# Altium schematic sheet 30. MICRO SDCARD INTERFACE.SchDoc: uSD CARD INTERFACE
size 513 x 386 mm; Project: PROC154E2(001)_SK_AM69; Issue: 1.0; RevCode: E3; Page Create Date: March  8, 1995; Variant Name: Core Design; Schematic Page Number: 30; Page Number: 30; Page Size: C; Comment: MISTRAL_TITLEBLK_CSIZE_1; Page Count: 62; Schematic Page Count: 62; Name: PROC154E2 001 SK AM69; DsnPath: C:\Users\danie\Downloads\sprr466c\PROC154E3_RP\PROC154E3_SCH.DSN; SchematicName: SCHEMATIC1; PageName: 30. MICRO SDCARD INTERFACE; PageSize: C; TopSchematic: True
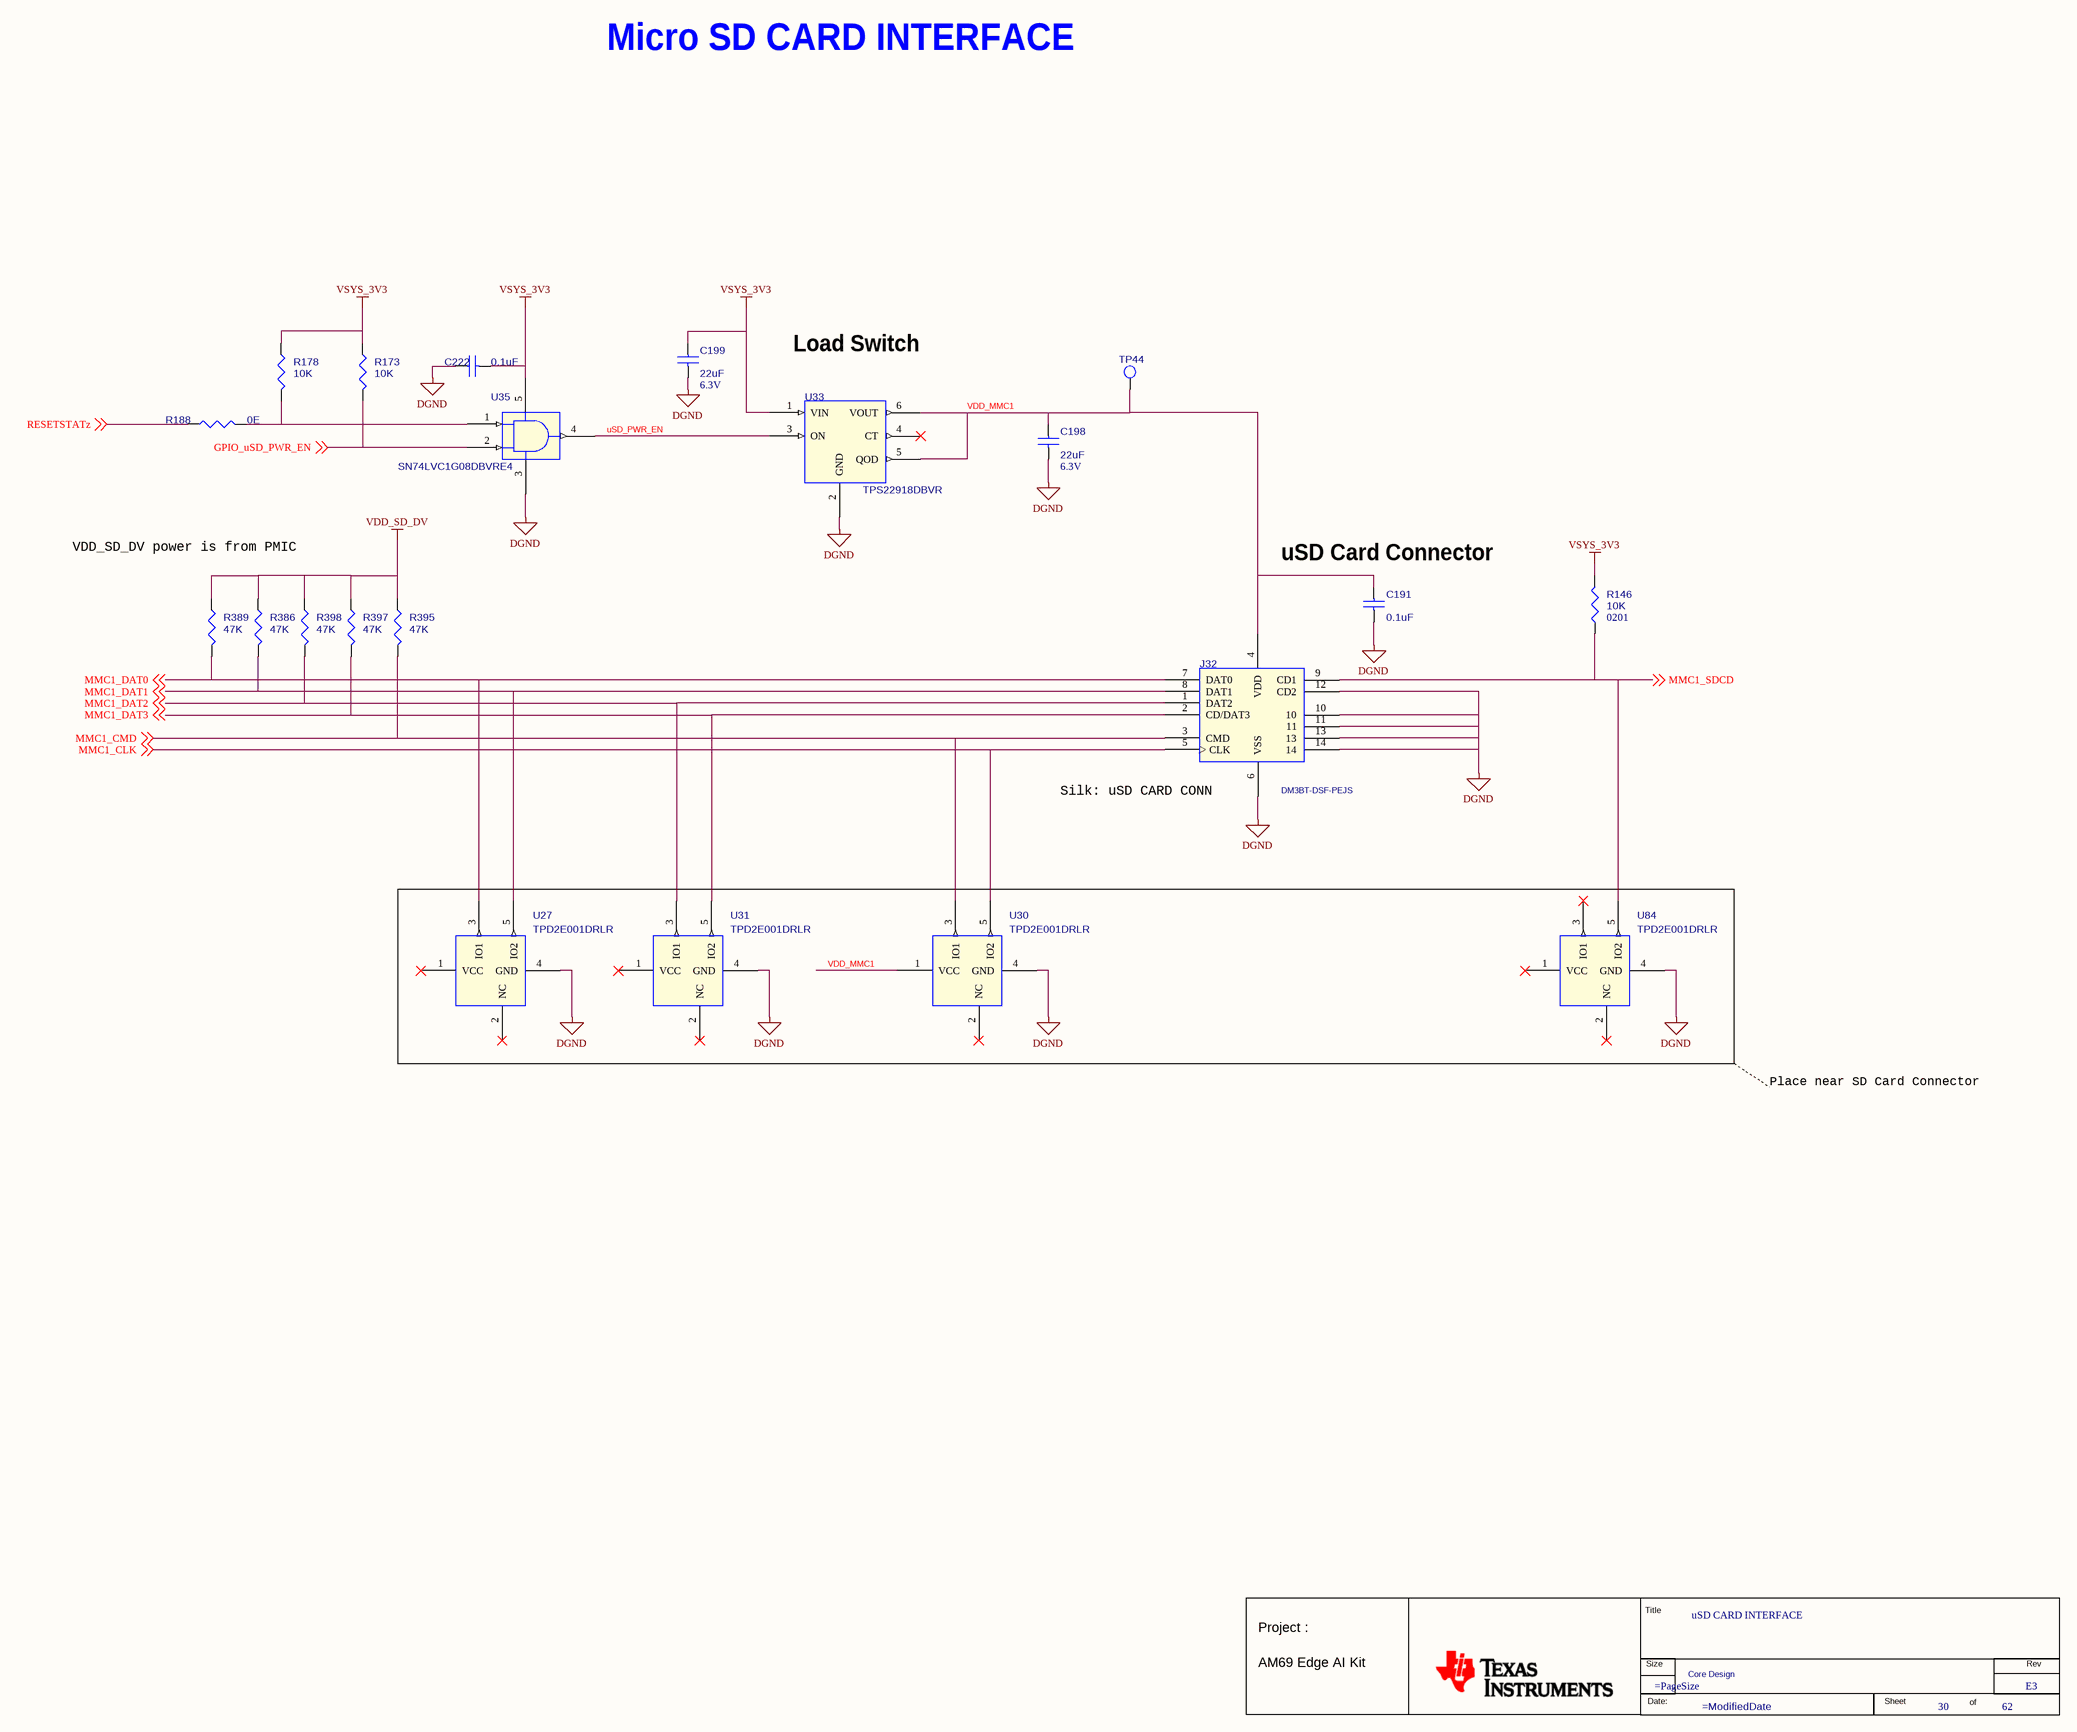
[diagram p0: 30. MICRO SDCARD INTERFACE.SchDoc]

## Parts
*  RevCode: E3  Title: uSD CARD INTERFACE  Page Number: 30  Page Count: 62  Variant Name: Core Design  (hidden comment: MISTRAL_TITLEBLK_CSIZE_1)  (graphical)
C191  0.1uF  [CAP0201_0-5]
C198  22uF  Voltage: 6.3V  [CAP0805_1-25]
C199  22uF  Voltage: 6.3V  [CAP0805_1-25]
C222  0.1uF  [CAP0201_0-5]
J32  Mfr_part_number: DM3BT-DSF-PEJS  [CON_SD10_DM3BT-DSF-PEJS_S_R_S_2-4]  (hidden comment: CON_SDCARD10_DM3BT-DSF-PEJS)
R146  10K  Package: 0201  [RES0201_0-5]
R173  10K  [RES0201_0-5]
R178  10K  [RES0201_0-5]
R188  0E  [RES0201_0-5]
R386  47K  [RES0402_0-5]
R389  47K  [RES0402_0-5]
R395  47K  [RES0402_0-5]
R397  47K  [RES0402_0-5]
R398  47K  [RES0402_0-5]
TP44  TP30_SMD  [TP30_SMD]  (value not drawn)
U27  TPD2E001DRLR  [SOT553-5_0-6]
U30  TPD2E001DRLR  [SOT553-5_0-6]
U31  TPD2E001DRLR  [SOT553-5_0-6]
U33  TPS22918DBVR  [SOT23-6]
U35  SN74LVC1G08DBVRE4  [SOT23-5]
U84  TPD2E001DRLR  [SOT553-5_0-6]

## Nets
DGND: C191.2 C198.2 C199.2 C222.1 J32.6(VSS) J32.10 J32.11 J32.12(CD2) J32.13 J32.14 U27.4(GND) U30.4(GND) U31.4(GND) U33.2(GND) U35.3(GND) U84.4(GND)
VDD_SD_DV: R386.1 R389.1 R395.1 R397.1 R398.1
VSYS_3V3: C199.1 C222.2 R146.1 R173.1 R178.1 U33.1(VIN) U35.5(VCC)
GPIO_uSD_PWR_EN: R173.2 U35.2(B) ; off-sheet GPIO_uSD_PWR_EN
MMC1_CLK: J32.5(CLK) U30.5(IO2) ; off-sheet MMC1_CLK
MMC1_CMD: J32.3(CMD) R395.2 U30.3(IO1) ; off-sheet MMC1_CMD
MMC1_DAT0: J32.7(DAT0) R389.2 U27.3(IO1) ; off-sheet MMC1_DAT0
MMC1_DAT1: J32.8(DAT1) R386.2 U27.5(IO2) ; off-sheet MMC1_DAT1
MMC1_DAT2: J32.1(DAT2) R398.2 U31.3(IO1) ; off-sheet MMC1_DAT2
MMC1_DAT3: J32.2(CD/DAT3) R397.2 U31.5(IO2) ; off-sheet MMC1_DAT3
MMC1_SDCD: J32.9(CD1) R146.2 U84.5(IO2) ; off-sheet MMC1_SDCD
RESETSTATz: R188.1 ; off-sheet RESETSTATz
uSD_PWR_EN: U33.3(ON) U35.4(Y)
VDD_MMC1: C191.1 C198.1 J32.4(VDD) TP44.1(TP) U30.1(VCC) U33.5(QOD) U33.6(VOUT)
NetR178_2: R178.2 R188.2 U35.1(A)

Not connected (* = marked no-connect by the designer): U27 1(VCC)* 2(NC)*; U30 2(NC)*; U31 1(VCC)* 2(NC)*; U33 4(CT)*; U84 1(VCC)* 2(NC)* 3(IO1)*

## Notes on the sheet
- Micro SD CARD INTERFACE
- Load Switch
- VDD_SD_DV power is from PMIC
- (near C191) uSD Card Connector
- (near J32) Silk: uSD CARD CONN
- Place near SD Card Connector
- (in symbol MISTRAL_TITLEBLK_CSIZE_1) Title; Project :; Size; Rev; AM69 Edge AI Kit; Date:; Sheet; of

## Library data of the parts
* = MISTRAL_TITLEBLK_CSIZE_1: Issue: 1.0; Project: PROC154E2(001)_SK_AM69; Name: PROC154E2 001 SK AM69; Page Create Date: March  8, 1995; Page Size: =PageSize; Page Modify Date: =ModifiedDate; Schematic Page Count: 62; Schematic Page Number: 30
C191 = CAP_Dup1: CAP CERAMIC 0.1uF 16V 10% X7S AUTO 0201; Part Reference: C191; Part_type: CAPACITORS\CERAMIC; Mfr_part_number: GRT033C71C104KE01D; Mfr_name: MURATA; Mistral Part No: 120021030007-R; Custom_Duty: 15%; Customs_HS_Code: 85322990; Wattage: NA; Project: J7ES_SK_BRD; Value: 0.1uF; MECHANICAL 3D STEP FILE: CAP0201_0-5; Chkd/date: MANIRAJA/110321; Crtd /date: ALVY/110321; Datasheet: Y:\MIS_DATABASE\DATASHEETS\CAPACITORS\GRT033C71C104KE01.PDF; Temperature: -55°C+125°C; Weight: 330mg; Height: 0.33MM; Distributor_part_number: 490-GRT033C71C104KE01DTR-ND; Distributor_name: DIGIKEY; Package: 0201; Voltage: 16V; Tolerance: 10%; PCB Footprint: CAP0201_0-5
C198 = CAP_Dup1: CAP CERAMIC 22uF 6.3V 20% X7T AUTO 0805; Part Reference: C198; Mistral Part No: 120018100065-R; Mfr_name: MURATA; Mfr_part_number: GCM21BD70J226ME36L; Part_type: CAPACITORS\CERAMIC; Project: TI_J7ES_EVM_SOM; Wattage: NA; Customs_HS_Code: 85322990; Custom_Duty: 15%; Value: 22uF; PCB Footprint: CAP0805_1-25; Footprint Path: Y:\MIS_DATABASE\Library\ALTIUM_TOOL\PCB_FOOTPRINTS\Altium_Footprint_Lib.PcbLib; Library Path: Y:\MIS_DATABASE\Library\ALTIUM_TOOL\SCHEMATICS_PARTS\MS_DISCRETE_Library.schlib; MECHANICAL 3D STEP FILE: CAP0805_1-25; Footprint Ref: CAP0805_1-25; Tolerance: 20%; Package: 0805; Distributor_name: MOUSER; Distributor_part_number: 81-GCM21BD70J226ME6L; Library Ref: CAP; Height: 1.25MM; Weight: NA; Temperature: -55°C+125°C; Datasheet: Y:\MIS_DATABASE\DATASHEETS\CAPACITORS\GCM-SERIES.PDF; Crtd /date: ALVY/251018; Chkd/date: MANIRAJA/261018
C199 = CAP_Dup1: CAP CERAMIC 22uF 6.3V 20% X7T AUTO 0805; Part Reference: C199; Part_type: CAPACITORS\CERAMIC; Mfr_part_number: GCM21BD70J226ME36L; Mfr_name: MURATA; Mistral Part No: 120018100065-R; Custom_Duty: 15%; Customs_HS_Code: 85322990; Wattage: NA; Project: TI_J7ES_EVM_SOM; Value: 22uF; PCB Footprint: CAP0805_1-25; Footprint Path: Y:\MIS_DATABASE\Library\ALTIUM_TOOL\PCB_FOOTPRINTS\Altium_Footprint_Lib.PcbLib; Library Path: Y:\MIS_DATABASE\Library\ALTIUM_TOOL\SCHEMATICS_PARTS\MS_DISCRETE_Library.schlib; MECHANICAL 3D STEP FILE: CAP0805_1-25; Footprint Ref: CAP0805_1-25; Chkd/date: MANIRAJA/261018; Crtd /date: ALVY/251018; Datasheet: Y:\MIS_DATABASE\DATASHEETS\CAPACITORS\GCM-SERIES.PDF; Temperature: -55°C+125°C; Weight: NA; Height: 1.25MM; Library Ref: CAP; Distributor_part_number: 81-GCM21BD70J226ME6L; Distributor_name: MOUSER; Package: 0805; Tolerance: 20%
C222 = CAP_Dup1: CAP CERAMIC 0.1uF 16V 10% X7S AUTO 0201; Part Reference: C222; Part_type: CAPACITORS\CERAMIC; Mfr_part_number: GRT033C71C104KE01D; Mfr_name: MURATA; Mistral Part No: 120021030007-R; Custom_Duty: 15%; Customs_HS_Code: 85322990; Wattage: NA; Project: J7ES_SK_BRD; Value: 0.1uF; MECHANICAL 3D STEP FILE: CAP0201_0-5; Chkd/date: MANIRAJA/110321; Crtd /date: ALVY/110321; Datasheet: Y:\MIS_DATABASE\DATASHEETS\CAPACITORS\GRT033C71C104KE01.PDF; Temperature: -55°C+125°C; Weight: 330mg; Height: 0.33MM; Distributor_part_number: 490-GRT033C71C104KE01DTR-ND; Distributor_name: DIGIKEY; Package: 0201; Voltage: 16V; Tolerance: 10%; PCB Footprint: CAP0201_0-5
J32 = CON_SDCARD_10_DM3BT-DSF-PEJS: CON MICROSD CARD PUSH-PUSH 10POS FEMALE RM RA SMD; Part Reference: J32; Part_type: CONNECTOR\MEMORY CARD; Mfr_name: HIROSE ELECTRIC; Mistral Part No: 150011010020-R; Custom_Duty: 24%; Customs_HS_Code: 85369090; Wattage: NA; Project: EBOOK; Value: CON_SDCARD10_DM3BT-DSF-PEJS; Footprint Path: Y:\MIS_DATABASE\Library\ALTIUM_TOOL\PCB_FOOTPRINTS\Altium_Footprint_Lib.PcbLib; Library Path: Y:\MIS_DATABASE\Library\ALTIUM_TOOL\SCHEMATICS_PARTS\MS_CONNECTOR_Library.schlib; MECHANICAL 3D STEP FILE: CON_SD10_DM3BT-DSF-PEJS_S_R_S_2-4; Chkd/date: MANIRAJA/080218; Crtd /date: BAVISH/190111; Datasheet: Y:\MIS_DATABASE\DATASHEETS\CONNECTORS\DM3-SERIES.PDF; Temperature: -25°C+85°C; Weight: 1.315g; Height: 2.38MM; Library Ref: CON_SDCARD_10_DM3BT-DSF-PEJS; Distributor_part_number: HR1942CT-ND; Distributor_name: DIGIKEY; Package: SMD; Voltage: NA; Tolerance: NA; Footprint Ref: CON_SD10_DM3BT-DSF-PEJS_S_R_S_2-4; PCB Footprint: CON_SD10_DM3BT-DSF-PEJS_S_R_S_2-4
R146 = RESISTOR_Dup2: RES 10K 1/20W 5% 0201; Part Reference: R146; Part_type: RESISTORS\FIXED; Mfr_part_number: RC0201JR-0710KL; Mfr_name: YAGEO AMERICA; Mistral Part No: 110010070051-R; Custom_Duty: 15%; Customs_HS_Code: 85332119; Voltage: NA; Project: GOLDEN-I LITE; Value: 10K; Footprint Path: Y:\MIS_DATABASE\Library\ALTIUM_TOOL\PCB_FOOTPRINTS\Altium_Footprint_Lib.PcbLib; Library Path: Y:\MIS_DATABASE\Library\ALTIUM_TOOL\SCHEMATICS_PARTS\MS_DISCRETE_Library.schlib; MECHANICAL 3D STEP FILE: RES0201_0-5; Footprint Ref: RES0201_0-5; Library Ref: RESISTOR; Chkd/date: MANIRAJA/050517; Crtd /date: MANIRAJA/050517; Datasheet: Y:\MIS_DATABASE\DATASHEETS\RESISTORS\RCXXXXL-SER_MAR18.PDF; Temperature: -55°C+125°C; Weight: 0.17mg; Height: 0.26MM; Distributor_part_number: 311-10KNCT-ND; Distributor_name: DIGIKEY; Wattage: 1/20W; Tolerance: 5%; PCB Footprint: RES0201_0-5
R173 = RESISTOR_Dup2: RES 10K 1/20W 5% 0201; Part Reference: R173; Mistral Part No: 110010070051-R; Mfr_name: YAGEO AMERICA; Mfr_part_number: RC0201JR-0710KL; Part_type: RESISTORS\FIXED; Project: GOLDEN-I LITE; Voltage: NA; Customs_HS_Code: 85332119; Custom_Duty: 15%; Value: 10K; Tolerance: 5%; Wattage: 1/20W; Package: 0201; Distributor_name: DIGIKEY; Distributor_part_number: 311-10KNCT-ND; Height: 0.26MM; Weight: 0.17mg; Temperature: -55°C+125°C; Datasheet: Y:\MIS_DATABASE\DATASHEETS\RESISTORS\RCXXXXL-SER_MAR18.PDF; Crtd /date: MANIRAJA/050517; Chkd/date: MANIRAJA/050517; MECHANICAL 3D STEP FILE: RES0201_0-5; Library Ref: RESISTOR; Footprint Ref: RES0201_0-5; Library Path: Y:\MIS_DATABASE\Library\ALTIUM_TOOL\SCHEMATICS_PARTS\MS_DISCRETE_Library.schlib; Footprint Path: Y:\MIS_DATABASE\Library\ALTIUM_TOOL\PCB_FOOTPRINTS\Altium_Footprint_Lib.PcbLib; PCB Footprint: RES0201_0-5
R178 = RESISTOR_Dup2: RES 10K 1/20W 5% 0201; Part Reference: R178; Part_type: RESISTORS\FIXED; Mfr_part_number: RC0201JR-0710KL; Mfr_name: YAGEO AMERICA; Mistral Part No: 110010070051-R; Custom_Duty: 15%; Customs_HS_Code: 85332119; Voltage: NA; Project: GOLDEN-I LITE; Value: 10K; Footprint Path: Y:\MIS_DATABASE\Library\ALTIUM_TOOL\PCB_FOOTPRINTS\Altium_Footprint_Lib.PcbLib; Library Path: Y:\MIS_DATABASE\Library\ALTIUM_TOOL\SCHEMATICS_PARTS\MS_DISCRETE_Library.schlib; MECHANICAL 3D STEP FILE: RES0201_0-5; Chkd/date: MANIRAJA/050517; Crtd /date: MANIRAJA/050517; Datasheet: Y:\MIS_DATABASE\DATASHEETS\RESISTORS\RCXXXXL-SER_MAR18.PDF; Temperature: -55°C+125°C; Weight: 0.17mg; Height: 0.26MM; Library Ref: RESISTOR; Distributor_part_number: 311-10KNCT-ND; Distributor_name: DIGIKEY; Package: 0201; Wattage: 1/20W; Tolerance: 5%; Footprint Ref: RES0201_0-5; PCB Footprint: RES0201_0-5
R188 = RESISTOR_Dup2: RES 0E 1/20W JUMPER 0201; Part Reference: R188; Part_type: RESISTORS\FIXED; Mfr_part_number: ERJ-1GN0R00C; Mfr_name: PANASONIC-ECG; Mistral Part No: 110009030078-R; Custom_Duty: 15%; Customs_HS_Code: 85332119; Voltage: NA; Project: SRMS-SAR_BRD; Value: 0E; Footprint Path: Y:\MIS_DATABASE\Library\ALTIUM_TOOL\PCB_FOOTPRINTS\Altium_Footprint_Lib.PcbLib; Library Path: Y:\MIS_DATABASE\Library\ALTIUM_TOOL\SCHEMATICS_PARTS\MS_DISCRETE_Library.schlib; MECHANICAL 3D STEP FILE: RES0201_0-5; Chkd/date: MANIRAJA/290421; Crtd /date: ALVY/290421; Datasheet: Y:\MIS_DATABASE\DATASHEETS\RESISTORS\PAN-ERJSER_NOV17.PDF; Temperature: -55°C+125°C; Weight: 0.15mg; Height: 0.26MM; Library Ref: RESISTOR; Distributor_part_number: P15979CT-ND; Distributor_name: DIGIKEY; Package: 0201; Wattage: 1/20W; Tolerance: NA; Footprint Ref: RES0201_0-5; PCB Footprint: RES0201_0-5
R386 = RESISTOR_Dup2: RES 47K 1/10W 5% 0402; Part Reference: R386; Mistral Part No: 110009030882-R; Mfr_name: PANASONIC-ECG; Mfr_part_number: ERJ-2GEJ473X; Part_type: RESISTORS\FIXED; Project: CTP02_REVA_BASE; Voltage: NA; Customs_HS_Code: 85332119; Custom_Duty: 15%; Value: 47K; Footprint Ref: RES0402_0-5; Tolerance: 5%; Wattage: 1/10W; Package: 0402; Distributor_name: DIGIKEY; Distributor_part_number: P47KJCT-ND; Library Ref: RESISTOR; Height: 0.40MM; Weight: 0.8mg; Temperature: -55°C+155°C; Datasheet: Y:\MIS_DATABASE\DATASHEETS\RESISTORS\PAN-ERJSER_NOV17.PDF; Crtd /date: MAZHAR/120505; Chkd/date: VASANTHA/281216; MECHANICAL 3D STEP FILE: RES0402_0-5; Library Path: Y:\MIS_DATABASE\Library\ALTIUM_TOOL\SCHEMATICS_PARTS\MS_DISCRETE_Library.schlib; Footprint Path: Y:\MIS_DATABASE\Library\ALTIUM_TOOL\PCB_FOOTPRINTS\Altium_Footprint_Lib.PcbLib; PCB Footprint: RES0402_0-5
R389 = RESISTOR_Dup2: RES 47K 1/10W 5% 0402; Part Reference: R389; Mistral Part No: 110009030882-R; Mfr_name: PANASONIC-ECG; Mfr_part_number: ERJ-2GEJ473X; Part_type: RESISTORS\FIXED; Project: CTP02_REVA_BASE; Voltage: NA; Customs_HS_Code: 85332119; Custom_Duty: 15%; Value: 47K; Footprint Ref: RES0402_0-5; Tolerance: 5%; Wattage: 1/10W; Package: 0402; Distributor_name: DIGIKEY; Distributor_part_number: P47KJCT-ND; Library Ref: RESISTOR; Height: 0.40MM; Weight: 0.8mg; Temperature: -55°C+155°C; Datasheet: Y:\MIS_DATABASE\DATASHEETS\RESISTORS\PAN-ERJSER_NOV17.PDF; Crtd /date: MAZHAR/120505; Chkd/date: VASANTHA/281216; MECHANICAL 3D STEP FILE: RES0402_0-5; Library Path: Y:\MIS_DATABASE\Library\ALTIUM_TOOL\SCHEMATICS_PARTS\MS_DISCRETE_Library.schlib; Footprint Path: Y:\MIS_DATABASE\Library\ALTIUM_TOOL\PCB_FOOTPRINTS\Altium_Footprint_Lib.PcbLib; PCB Footprint: RES0402_0-5
R395 = RESISTOR_Dup2: RES 47K 1/10W 5% 0402; Part Reference: R395; Part_type: RESISTORS\FIXED; Mfr_part_number: ERJ-2GEJ473X; Mfr_name: PANASONIC-ECG; Mistral Part No: 110009030882-R; Custom_Duty: 15%; Customs_HS_Code: 85332119; Voltage: NA; Project: CTP02_REVA_BASE; Value: 47K; Footprint Path: Y:\MIS_DATABASE\Library\ALTIUM_TOOL\PCB_FOOTPRINTS\Altium_Footprint_Lib.PcbLib; Library Path: Y:\MIS_DATABASE\Library\ALTIUM_TOOL\SCHEMATICS_PARTS\MS_DISCRETE_Library.schlib; MECHANICAL 3D STEP FILE: RES0402_0-5; Chkd/date: VASANTHA/281216; Crtd /date: MAZHAR/120505; Datasheet: Y:\MIS_DATABASE\DATASHEETS\RESISTORS\PAN-ERJSER_NOV17.PDF; Temperature: -55°C+155°C; Weight: 0.8mg; Height: 0.40MM; Library Ref: RESISTOR; Distributor_part_number: P47KJCT-ND; Distributor_name: DIGIKEY; Package: 0402; Wattage: 1/10W; Tolerance: 5%; Footprint Ref: RES0402_0-5; PCB Footprint: RES0402_0-5
R397 = RESISTOR_Dup2: RES 47K 1/10W 5% 0402; Part Reference: R397; Part_type: RESISTORS\FIXED; Mfr_part_number: ERJ-2GEJ473X; Mfr_name: PANASONIC-ECG; Mistral Part No: 110009030882-R; Custom_Duty: 15%; Customs_HS_Code: 85332119; Voltage: NA; Project: CTP02_REVA_BASE; Value: 47K; Footprint Path: Y:\MIS_DATABASE\Library\ALTIUM_TOOL\PCB_FOOTPRINTS\Altium_Footprint_Lib.PcbLib; Library Path: Y:\MIS_DATABASE\Library\ALTIUM_TOOL\SCHEMATICS_PARTS\MS_DISCRETE_Library.schlib; MECHANICAL 3D STEP FILE: RES0402_0-5; Chkd/date: VASANTHA/281216; Crtd /date: MAZHAR/120505; Datasheet: Y:\MIS_DATABASE\DATASHEETS\RESISTORS\PAN-ERJSER_NOV17.PDF; Temperature: -55°C+155°C; Weight: 0.8mg; Height: 0.40MM; Library Ref: RESISTOR; Distributor_part_number: P47KJCT-ND; Distributor_name: DIGIKEY; Package: 0402; Wattage: 1/10W; Tolerance: 5%; Footprint Ref: RES0402_0-5; PCB Footprint: RES0402_0-5
R398 = RESISTOR_Dup2: RES 47K 1/10W 5% 0402; Part Reference: R398; Part_type: RESISTORS\FIXED; Mfr_part_number: ERJ-2GEJ473X; Mfr_name: PANASONIC-ECG; Mistral Part No: 110009030882-R; Custom_Duty: 15%; Customs_HS_Code: 85332119; Voltage: NA; Project: CTP02_REVA_BASE; Value: 47K; Footprint Path: Y:\MIS_DATABASE\Library\ALTIUM_TOOL\PCB_FOOTPRINTS\Altium_Footprint_Lib.PcbLib; Library Path: Y:\MIS_DATABASE\Library\ALTIUM_TOOL\SCHEMATICS_PARTS\MS_DISCRETE_Library.schlib; MECHANICAL 3D STEP FILE: RES0402_0-5; Chkd/date: VASANTHA/281216; Crtd /date: MAZHAR/120505; Datasheet: Y:\MIS_DATABASE\DATASHEETS\RESISTORS\PAN-ERJSER_NOV17.PDF; Temperature: -55°C+155°C; Weight: 0.8mg; Height: 0.40MM; Library Ref: RESISTOR; Distributor_part_number: P47KJCT-ND; Distributor_name: DIGIKEY; Package: 0402; Wattage: 1/10W; Tolerance: 5%; Footprint Ref: RES0402_0-5; PCB Footprint: RES0402_0-5
TP44 = TESTPOINT_Dup1: TESTPOINT CIR 30 SMD; Part Reference: TP44; Mfr_name: LOCAL; Mistral Part No: 130009030930; Custom_Duty: NA; Project: BT MODULE_CSRBC04; Value: TP30_SMD; Customs_HS_Code: NA; RoHS: NA; Footprint Ref: TP30_SMD; Library Ref: TESTPOINT; Footprint Path: Y:\MIS_DATABASE\Library\ALTIUM_TOOL\PCB_FOOTPRINTS\Altium_Footprint_Lib.PcbLib; Library Path: Y:\MIS_DATABASE\Library\ALTIUM_TOOL\SCHEMATICS_PARTS\MS_DISCRETE_Library.schlib; MECHANICAL 3D STEP FILE: NA; Datasheet: NA; Temperature: NA; Weight: NA; Wattage: NA; Voltage: NA; Tolerance: NA; Chkd/date: SHREESHAIL/171006; Crtd /date: MAZHAR/171006; Height: NA; Distributor_part_number: NA; Distributor_name: NA; Package: SMD; Part_type: TESTPOINT; Mfr_part_number: TP30_SMD; PCB Footprint: TP30_SMD
U27 = TPD2E001DRLR_SOT-5_1: IC ESD-PROTECTION DIODE ARRAYS SOT-5; Part Reference: U27; Part_type: ICS\ANALOG\ACTIVE FILTER; Mfr_name: TEXAS INSTRUMENTS; Mistral Part No: 140110060007-R; Automotive Alternate_mfr_part_number: TPD2E001IDRLRQ1; Wattage: NA; Custom_Duty: 15%; Customs_HS_Code: 85423100; Project: CENTAURUS; Value: TPD2E001DRLR; Footprint Path: Y:\MIS_DATABASE\Library\ALTIUM_TOOL\PCB_FOOTPRINTS\Altium_Footprint_Lib.PcbLib; Library Path: Y:\MIS_DATABASE\Library\ALTIUM_TOOL\SCHEMATICS_PARTS\MS_FILTER_Library.schlib; MECHANICAL 3D STEP FILE: SOT553-5_0-6; Voltage: NA; Tolerance: NA; Footprint Ref: SOT553-5_0-6; Chkd/date: NAVEED/150714; Crtd /date: MUDDU/250510; Datasheet: Y:\MIS_DATABASE\DATASHEETS\ICS\MISC\TPD2E001DRLR.PDF; Temperature: -40°C+85°C; Weight: 2.8mg; Height: 0.60MM; Library Ref: TPD2E001DRLR_SOT-5; Distributor_part_number: 296-21883-1-ND; Distributor_name: DIGIKEY; Package: SOT-5; Mfr_part_number: TPD2E001DRLR; Automotive Alternate_mfr_name: TEXAS INSTRUMENTS; PCB Footprint: SOT553-5_0-6
U30 = TPD2E001DRLR_SOT-5_1: IC ESD-PROTECTION DIODE ARRAYS SOT-5; Part Reference: U30; Part_type: ICS\ANALOG\ACTIVE FILTER; Mfr_name: TEXAS INSTRUMENTS; Mistral Part No: 140110060007-R; Automotive Alternate_mfr_part_number: TPD2E001IDRLRQ1; Wattage: NA; Custom_Duty: 15%; Customs_HS_Code: 85423100; Project: CENTAURUS; Value: TPD2E001DRLR; Footprint Path: Y:\MIS_DATABASE\Library\ALTIUM_TOOL\PCB_FOOTPRINTS\Altium_Footprint_Lib.PcbLib; Library Path: Y:\MIS_DATABASE\Library\ALTIUM_TOOL\SCHEMATICS_PARTS\MS_FILTER_Library.schlib; MECHANICAL 3D STEP FILE: SOT553-5_0-6; Voltage: NA; Tolerance: NA; Footprint Ref: SOT553-5_0-6; Chkd/date: NAVEED/150714; Crtd /date: MUDDU/250510; Datasheet: Y:\MIS_DATABASE\DATASHEETS\ICS\MISC\TPD2E001DRLR.PDF; Temperature: -40°C+85°C; Weight: 2.8mg; Height: 0.60MM; Library Ref: TPD2E001DRLR_SOT-5; Distributor_part_number: 296-21883-1-ND; Distributor_name: DIGIKEY; Package: SOT-5; Mfr_part_number: TPD2E001DRLR; Automotive Alternate_mfr_name: TEXAS INSTRUMENTS; PCB Footprint: SOT553-5_0-6
U31 = TPD2E001DRLR_SOT-5_1: IC ESD-PROTECTION DIODE ARRAYS SOT-5; Part Reference: U31; Part_type: ICS\ANALOG\ACTIVE FILTER; Mfr_name: TEXAS INSTRUMENTS; Mistral Part No: 140110060007-R; Automotive Alternate_mfr_part_number: TPD2E001IDRLRQ1; Custom_Duty: 15%; Customs_HS_Code: 85423100; Project: CENTAURUS; Tolerance: NA; Value: TPD2E001DRLR; Chkd/date: NAVEED/150714; Crtd /date: MUDDU/250510; Datasheet: Y:\MIS_DATABASE\DATASHEETS\ICS\MISC\TPD2E001DRLR.PDF; Temperature: -40°C+85°C; Weight: 2.8mg; Height: 0.60MM; Library Ref: TPD2E001DRLR_SOT-5; Distributor_part_number: 296-21883-1-ND; Distributor_name: DIGIKEY; Package: SOT-5; Mfr_part_number: TPD2E001DRLR; Footprint Ref: SOT553-5_0-6; Voltage: NA; Wattage: NA; MECHANICAL 3D STEP FILE: SOT553-5_0-6; Library Path: Y:\MIS_DATABASE\Library\ALTIUM_TOOL\SCHEMATICS_PARTS\MS_FILTER_Library.schlib; Footprint Path: Y:\MIS_DATABASE\Library\ALTIUM_TOOL\PCB_FOOTPRINTS\Altium_Footprint_Lib.PcbLib; Automotive Alternate_mfr_name: TEXAS INSTRUMENTS; PCB Footprint: SOT553-5_0-6
U33 = TPS22918DBVR_SOT23-6: IC ON RESISTANCE LOAD SWITCH SOT23-6; Part Reference: U33; Part_type: ICS\POWER; Mfr_name: TEXAS INSTRUMENTS; Mistral Part No: 142016050007-R; Automotive Alternate_mfr_part_number: TPS22918TDBVRQ1; Custom_Duty: 15%; Customs_HS_Code: 85423100; Wattage: NA; Project: TMDXCSK8127; Value: TPS22918DBVR; Chkd/date: VASANTHA/130516; Crtd /date: VASANTHA/130516; Datasheet: Y:\MIS_DATABASE\DATASHEETS\ICS\POWER\TPS22918DBV.PDF; Temperature: -40°C to 105°C; Weight: NA; Height: 1.45MM; Library Ref: TPS22918DBVR_SOT23-6; Distributor_part_number: TPS22918DBVR-ND; Distributor_name: DIGIKEY; Package: SOT23-6; Voltage: NA; Tolerance: NA; Mfr_part_number: TPS22918DBVR; Automotive Alternate_mfr_name: TEXAS INSTRUMENTS; PCB Footprint: SOT23-6
U35 = SN74LVC1G08DBVRE4_SOT23-5: IC SINGLE 2-INPUT POSITIVE AND GATE SOT23-5; Part Reference: U35; Mistral Part No: 141009060026-R; Mfr_name: TEXAS INSTRUMENTS; Part_type: ICS\DIGITAL\GATES; Automotive Alternate_mfr_part_number: SN74LVC1G08QDBVRQ1; Project: KHAN_MAIN; Customs_HS_Code: 85423100; Custom_Duty: 15%; Value: SN74LVC1G08DBVRE4; Mfr_part_number: SN74LVC1G08DBVRE4; Package: SOT23-5; Distributor_name: DIGIKEY; Distributor_part_number: SN74LVC1G08DBVRE4-ND; Height: 1.45MM; Temperature: -40°C+85°C; Datasheet: Y:\MIS_DATABASE\DATASHEETS\ICS\DIGITAL\GATES\SN74LVC1G08.PDF; Crtd /date: USMAN/151008; Chkd/date: SUHAS/221010; RoHS: Sb/ Br FREE; Library Ref: SN74LVC1G08DBVRE4_SOT23-5; Automotive Alternate_mfr_name: TEXAS INSTRUMENTS; PCB Footprint: SOT23-5
U84 = TPD2E001DRLR_SOT-5_1: IC ESD-PROTECTION DIODE ARRAYS SOT-5; Part Reference: U84; Automotive Alternate_mfr_part_number: TPD2E001IDRLRQ1; Automotive Alternate_mfr_name: TEXAS INSTRUMENTS; Mistral Part No: 140110060007-R; Part_type: ICS\ANALOG\ACTIVE FILTER; Wattage: NA; Project: CENTAURUS; Customs_HS_Code: 85423100; Custom_Duty: 15%; Value: TPD2E001DRLR; Footprint Path: Y:\MIS_DATABASE\Library\ALTIUM_TOOL\PCB_FOOTPRINTS\Altium_Footprint_Lib.PcbLib; Library Path: Y:\MIS_DATABASE\Library\ALTIUM_TOOL\SCHEMATICS_PARTS\MS_FILTER_Library.schlib; MECHANICAL 3D STEP FILE: SOT553-5_0-6; Voltage: NA; Tolerance: NA; Footprint Ref: SOT553-5_0-6; Mfr_name: TEXAS INSTRUMENTS; Mfr_part_number: TPD2E001DRLR; Package: SOT-5; Distributor_name: DIGIKEY; Distributor_part_number: 296-21883-1-ND; Library Ref: TPD2E001DRLR_SOT-5; Height: 0.60MM; Weight: 2.8mg; Temperature: -40°C+85°C; Datasheet: Y:\MIS_DATABASE\DATASHEETS\ICS\MISC\TPD2E001DRLR.PDF; Crtd /date: MUDDU/250510; Chkd/date: NAVEED/150714; PCB Footprint: SOT553-5_0-6